# EAGLE design Nokia5110_BackCard (EAGLE 6.5.0)
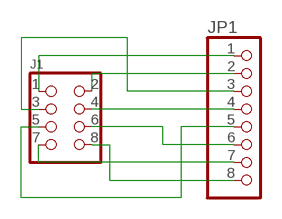
[diagram p0: schematic, sheet 1]

## Parts
J1  CON_HEADER_2X04-SHRD_PTH  [PINSHRD_PTH_2X04]
JP1  PINHD-1X8  [1X08]

## Nets
GND: J1.8 JP1.8
N$1: J1.1 JP1.1
N$2: J1.2 JP1.2
N$3: J1.4 JP1.4
N$6: J1.7 JP1.7
N$7: J1.5 JP1.5
N$8: J1.3 JP1.3
VCC: J1.6 JP1.6

## Library data of the parts
J1 = dp_devices:CON_HEADER_2X04
JP1 = pinhead:PINHD-1X8: PIN HEADER

## Board
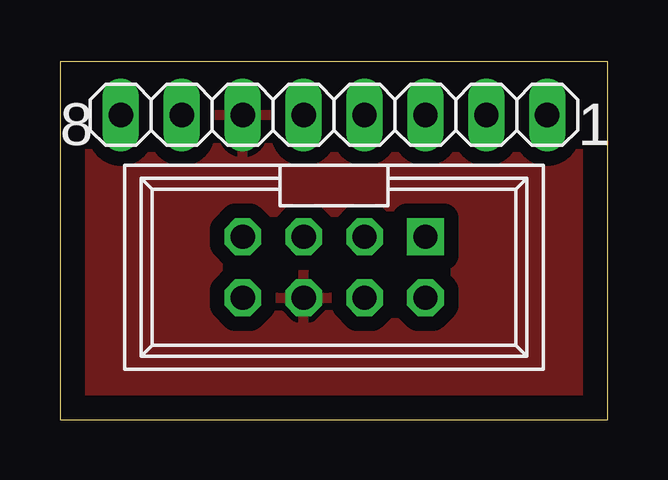
[diagram p1: board, top side]
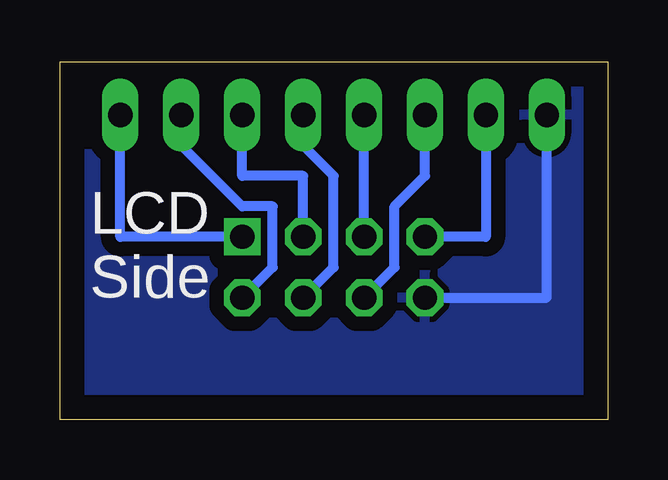
[diagram p2: board, bottom side, seen from below]

Size 22.84 x 14.91 mm. Coordinates in mm from the lower left corner, seen from the top.
Outline: 0,0 22.84,0 22.84,14.91 0,14.91 0,0
Copper layers (1*16): Top 0.035mm / dielectric 1.5mm / Bottom 0.035mm
Design rules "default": minimum track width 10mil, minimum drill 24mil, track to track 8mil, track to pad 8mil, pad to pad 8mil, via to via 8mil, smd to smd 8mil, copper to edge 40mil, drill to drill 8mil, minimum pad ring 10mil, minimum via ring 8mil, stop-mask expansion 4mil, vias tented up to drill 0mil, thermal gap 10mil

### Footprints (pad centres in the part's own frame; a part is rotated, then mirrored left to right if it is on the bottom)
PINSHRD_PTH_2X04 = drill 1.016 square: 1 -3.81,-1.27 | drill 1.016 octagon: 2 -3.81,1.27; 3 -1.27,-1.27; 4 -1.27,1.27; 5 1.27,-1.27; 6 1.27,1.27; 7 3.81,-1.27; 8 3.81,1.27
1X08 = drill 1.016 long: 1 -8.89,0; 2 -6.35,0; 3 -3.81,0; 4 -1.27,0; 5 1.27,0; 6 3.81,0; 7 6.35,0; 8 8.89,0

### Placement (x,y rotation side)
J1  11.43,6.35 180 top
JP1  11.43,12.7 180 top

### Tracks (layer width: path | path; a pad name or v marks a point on that pad's centre or on a via)
GND
  Bottom 0.406: J1.8 2.54,5.08 JP1.8
  pour Bottom (isolate 0.61): 0,0 22.86,0 22.86,15.24 0,15.24
N$1
  Bottom 0.406: J1.1 20.32,7.62 JP1.1
N$2
  Bottom 0.406: J1.2 13.97,6.35 13.97,8.89 15.24,8.89 17.78,11.43 JP1.2
N$3
  Bottom 0.406: J1.4 11.43,6.35 11.43,10.16 12.7,11.43 JP1.4
N$6
  Bottom 0.406: JP1.7 5.08,7.62 J1.7
N$7
  Bottom 0.406: J1.5 JP1.5
N$8
  Bottom 0.406: J1.3 12.7,10.16 15.24,10.16 JP1.3
VCC
  Bottom 0.406: J1.6 8.89,6.35 8.89,8.89 7.62,10.16 JP1.6
  pour Top (isolate 0.61): 0,0 22.86,0 22.86,15.24 0,15.24

### Text on the board
tNames: 8 | 1
bNames: LCD / Side